# EAGLE design Schematic (EAGLE 6.4)
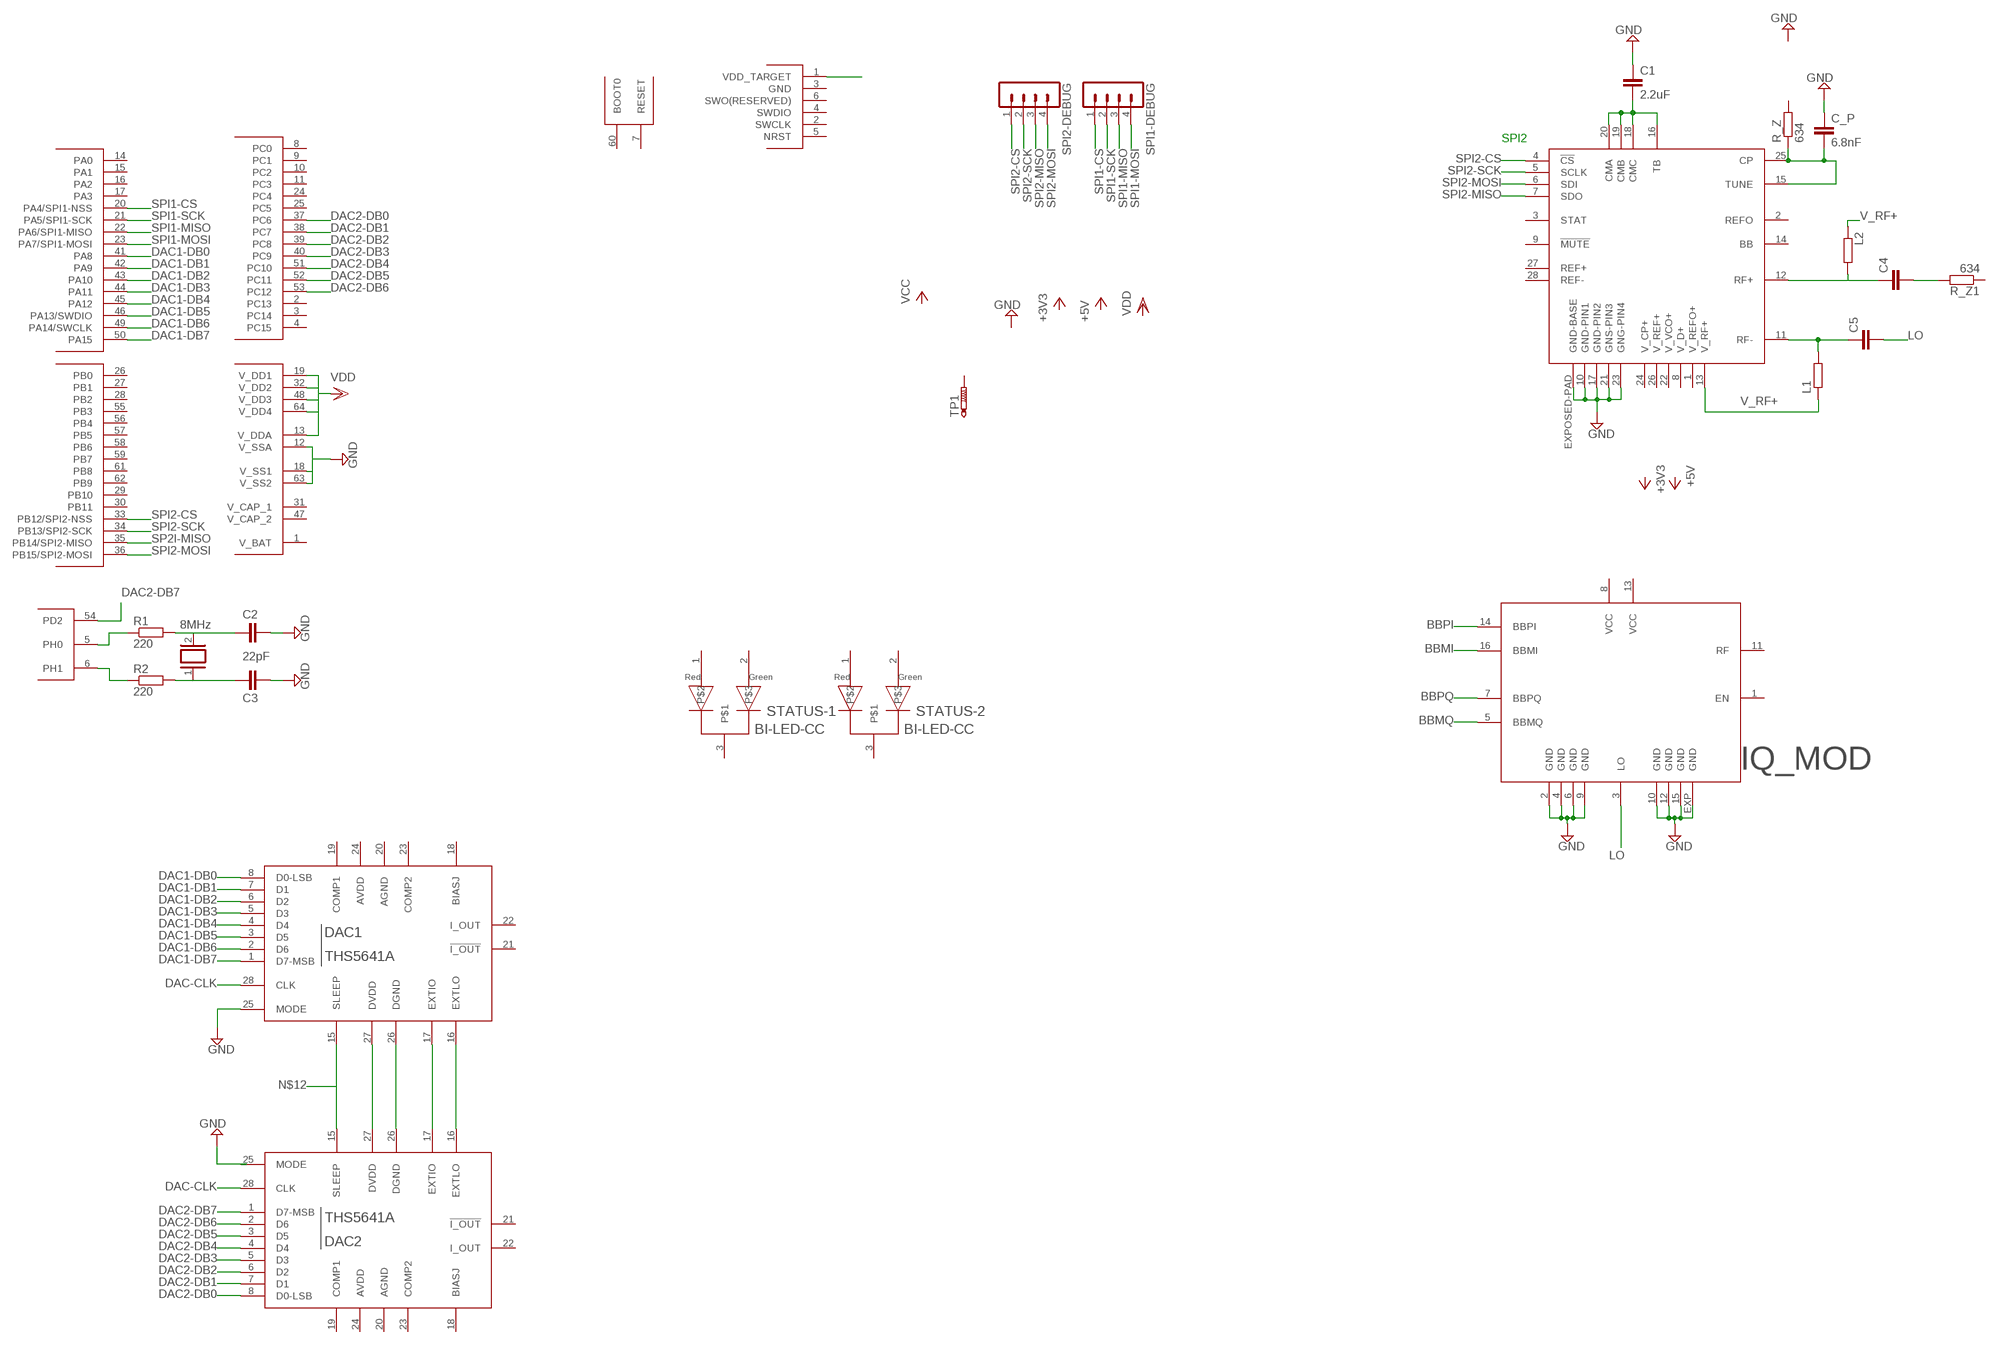
[diagram p0: schematic, sheet 1]

## Parts
C1  2.2uF  C-EUC0603  [C0603]
C2  22pF  C-EUC0603  [C0603]
C3  22pF  C-EUC0603  [C0603]
C4  C-EUC1210  [C1210]
C5  C-EUC1210  [C1210]
C_P  6.8nF  C-EUC0805  [C0805]
DAC1  THS5641A  [SO28]
DAC2  THS5641A  [SO28]
IQ_MOD  LT5568  [QFN-16]
L1  R-EU_R0402  [R0402]
L2  R-EU_R0402  [R0402]
Q1  8MHz  XTAL/S  [QS]
R1  220  R-EU_R0603  [R0603]
R2  220  R-EU_R0603  [R0603]
R_Z  634  R-EU_R0805  [R0805]
R_Z1  634  R-EU_R0805  [R0805]
SPI1-DEBUG  MA04-1  [MA04-1]
SPI2-DEBUG  MA04-1  [MA04-1]
STATUS-1  BI-LED-CC  [SOT-23]
STATUS-2  BI-LED-CC  [SOT-23]
TP1  PTR1PAD1-20Y  [P1-20Y]
U$1  STM32F415RGT6  [LQFP-64]
U$2  SWD-HEADER  [6PIN-HEADER]
U$3  LTC6946  [QFN-28]

## Nets
BBMI: IQ_MOD.16(BBMI)
BBMQ: IQ_MOD.5(BBMQ)
BBPI: IQ_MOD.14(BBPI)
BBPQ: IQ_MOD.7(BBPQ)
DAC1-DB0: DAC1.8(D0-LSB) U$1.41(PORT_A:PA8)
DAC1-DB1: DAC1.7(D1) U$1.42(PORT_A:PA9)
DAC1-DB2: DAC1.6(D2) U$1.43(PORT_A:PA10)
DAC1-DB3: DAC1.5(D3) U$1.44(PORT_A:PA11)
DAC1-DB4: DAC1.4(D4) U$1.45(PORT_A:PA12)
DAC1-DB5: DAC1.3(D5) U$1.46(PORT_A:PA13/SWDIO)
DAC1-DB6: DAC1.2(D6) U$1.49(PORT_A:PA14/SWCLK)
DAC1-DB7: DAC1.1(D7-MSB) U$1.50(PORT_A:PA15)
DAC2-DB0: DAC2.8(D0-LSB) U$1.37(PORT_C:PC6)
DAC2-DB1: DAC2.7(D1) U$1.38(PORT_C:PC7)
DAC2-DB2: DAC2.6(D2) U$1.39(PORT_C:PC8)
DAC2-DB3: DAC2.5(D3) U$1.40(PORT_C:PC9)
DAC2-DB4: DAC2.4(D4) U$1.51(PORT_C:PC10)
DAC2-DB5: DAC2.3(D5) U$1.52(PORT_C:PC11)
DAC2-DB6: DAC2.2(D6) U$1.53(PORT_C:PC12)
DAC2-DB7: DAC2.1(D7-MSB) U$1.54(PD2)
DAC-CLK: DAC1.28(CLK) DAC2.28(CLK)
GND: C1.1 C2.2 C3.2 C_P.1 DAC1.25(MODE) IQ_MOD.2(GND) IQ_MOD.4(GND) IQ_MOD.6(GND) IQ_MOD.9(GND) IQ_MOD.10(GND) IQ_MOD.12(GND) IQ_MOD.15(GND) IQ_MOD.EXP(GND) U$1.12(POWER:V_SSA) U$1.18(POWER:V_SS1) U$1.63(POWER:V_SS2) U$3.10(GND-PIN1) U$3.17(GND-PIN2) U$3.21(GNS-PIN3) U$3.23(GNG-PIN4) U$3.EXPOSED-PAD(GND-BASE)
LO: C5.2 IQ_MOD.3(LO)
N$1: C_P.2 R_Z.1 U$3.15(TUNE) U$3.25(CP)
N$2: C1.2 U$3.16(TB) U$3.18(CMC) U$3.19(CMB) U$3.20(CMA)
N$3: U$2.1(VDD_TARGET)
N$4: C3.1 Q1.1 R2.2
N$5: C2.1 Q1.2 R1.2
N$6: R1.1 U$1.5(PH0)
N$7: R2.1 U$1.6(PH1)
N$8: C5.1 L1.2 U$3.11(RF-)
N$9: C4.1 L2.2 U$3.12(RF+)
N$10: C4.2 R_Z1.2
N$11: DAC1.27(DVDD) DAC2.27(DVDD)
N$12: DAC1.15(SLEEP) DAC2.15(SLEEP)
N$13: DAC1.26(DGND) DAC2.26(DGND)
N$14: DAC1.17(EXTIO) DAC2.17(EXTIO)
N$15: DAC1.16(EXTLO) DAC2.16(EXTLO)
SP2I-MISO: U$1.35(PORT_B:PB14/SPI2-MISO)
SPI1-CS: SPI1-DEBUG.1 U$1.20(PORT_A:PA4/SPI1-NSS)
SPI1-MISO: SPI1-DEBUG.3 U$1.22(PORT_A:PA6/SPI1-MISO)
SPI1-MOSI: SPI1-DEBUG.4 U$1.23(PORT_A:PA7/SPI1-MOSI)
SPI1-SCK: SPI1-DEBUG.2 U$1.21(PORT_A:PA5/SPI1-SCK)
SPI2-CS: SPI2-DEBUG.1 U$1.33(PORT_B:PB12/SPI2-NSS) U$3.4(!CS!)
SPI2-MISO: SPI2-DEBUG.3 U$3.7(SDO)
SPI2-MOSI: SPI2-DEBUG.4 U$1.36(PORT_B:PB15/SPI2-MOSI) U$3.6(SDI)
SPI2-SCK: SPI2-DEBUG.2 U$1.34(PORT_B:PB13/SPI2-SCK) U$3.5(SCLK)
V_RF+: L1.1 L2.1 U$3.13(V_RF+)
VDD: U$1.13(POWER:V_DDA) U$1.19(POWER:V_DD1) U$1.32(POWER:V_DD2) U$1.48(POWER:V_DD3) U$1.64(POWER:V_DD4)
Unconnected: DAC1.18(BIASJ) DAC1.19(COMP1) DAC1.20(AGND) DAC1.21(!I_OUT!) DAC1.22(I_OUT) DAC1.23(COMP2) DAC1.24(AVDD) DAC2.18(BIASJ) DAC2.19(COMP1) DAC2.20(AGND) DAC2.21(!I_OUT!) DAC2.22(I_OUT) DAC2.23(COMP2) DAC2.24(AVDD) DAC2.25(MODE) IQ_MOD.1(EN) IQ_MOD.8(VCC) IQ_MOD.11(RF) IQ_MOD.13(VCC) R_Z1.1 R_Z.2 STATUS-1.1 STATUS-1.2 STATUS-1.3 STATUS-2.1 STATUS-2.2 STATUS-2.3 TP1.TP U$1.1(POWER:V_BAT) U$1.2(PORT_C:PC13) U$1.3(PORT_C:PC14) U$1.4(PORT_C:PC15) U$1.7(FUNCTIONS:RESET) U$1.8(PORT_C:PC0) U$1.9(PORT_C:PC1) U$1.10(PORT_C:PC2) U$1.11(PORT_C:PC3) U$1.14(PORT_A:PA0) U$1.15(PORT_A:PA1) U$1.16(PORT_A:PA2) U$1.17(PORT_A:PA3) U$1.24(PORT_C:PC4) U$1.25(PORT_C:PC5) U$1.26(PORT_B:PB0) U$1.27(PORT_B:PB1) U$1.28(PORT_B:PB2) U$1.29(PORT_B:PB10) U$1.30(PORT_B:PB11) U$1.31(POWER:V_CAP_1) U$1.47(POWER:V_CAP_2) U$1.55(PORT_B:PB3) U$1.56(PORT_B:PB4) U$1.57(PORT_B:PB5) U$1.58(PORT_B:PB6) U$1.59(PORT_B:PB7) U$1.60(FUNCTIONS:BOOT0) U$1.61(PORT_B:PB8) U$1.62(PORT_B:PB9) U$2.2(SWCLK) U$2.3(GND) U$2.4(SWDIO) U$2.5(NRST) U$2.6(SWO(RESERVED)) U$3.1(V_REFO+) U$3.2(REFO) U$3.3(STAT) U$3.8(V_D+) U$3.9(!MUTE!) U$3.14(BB) U$3.22(V_VCO+) U$3.24(V_CP+) U$3.26(V_REF+) U$3.27(REF+) U$3.28(REF-)

## Notes on the sheet
- SPI2

## Library data of the parts
C1 C4 C5 = rcl:C-EU: CAPACITOR, European symbol
C2 C3 C_P = resistor:C-EU: CAPACITOR, European symbol
DAC1 DAC2 = Lynx components:THS5641A
IQ_MOD = Lynx components:LT5568
L1 L2 R_Z R_Z1 = rcl:R-EU_: RESISTOR, European symbol
Q1 = special:XTAL/S: CRYSTAL
R1 R2 = resistor:R-EU_: RESISTOR, European symbol
SPI1-DEBUG SPI2-DEBUG = con-lstb:MA04-1: PIN HEADER; OC_FARNELL: unknown; OC_NEWARK: unknown
STATUS-1 STATUS-2 = Lynx components:BI-LED-CC
TP1 = testpad:PTR1: TEST PIN
U$1 = Lynx components:STM32F415RGT6
U$2 = Lynx components:SWD-HEADER
U$3 = Lynx components:LTC6946

## Board
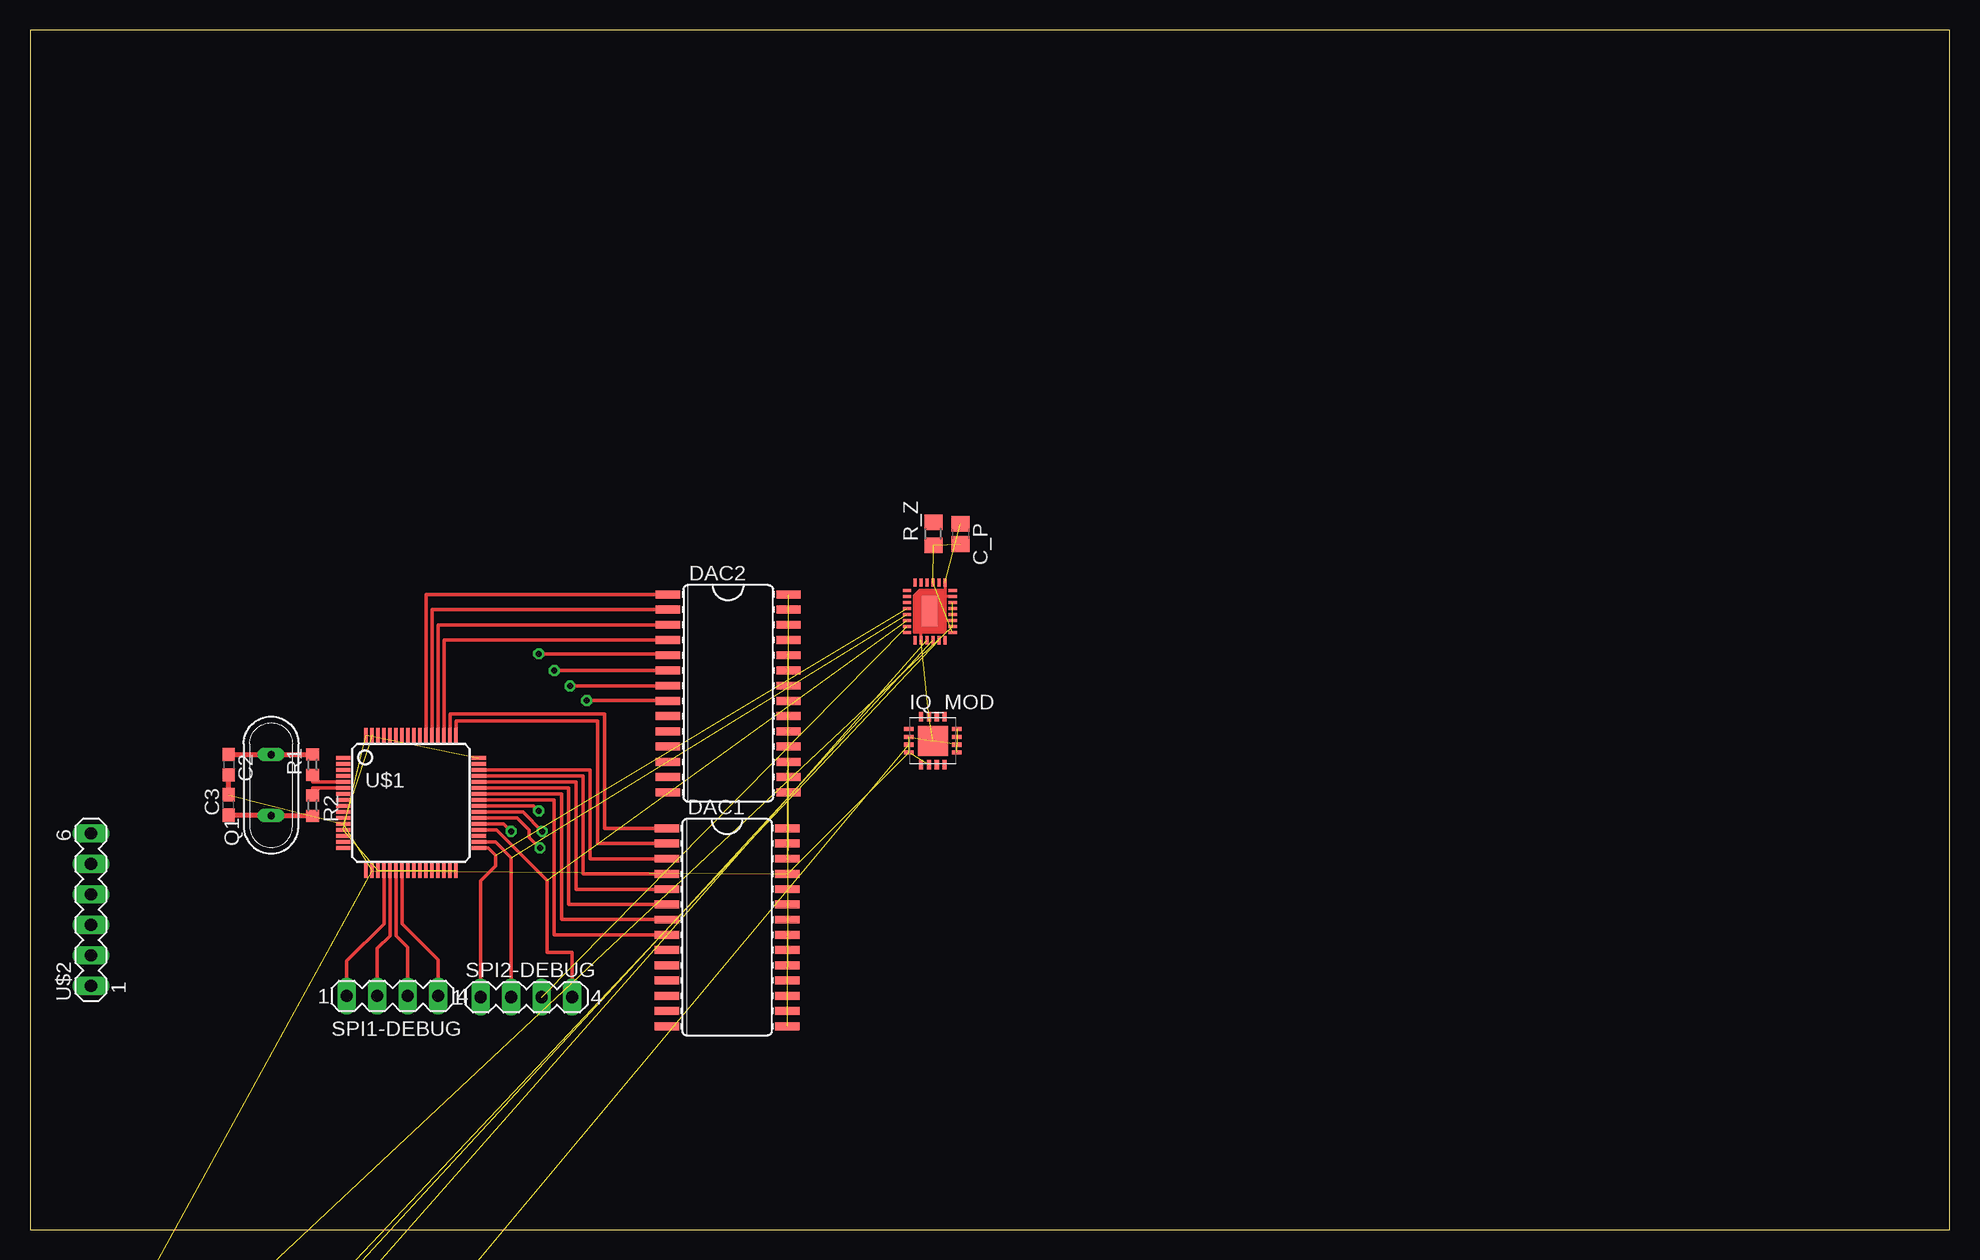
[diagram p1: board, top side]
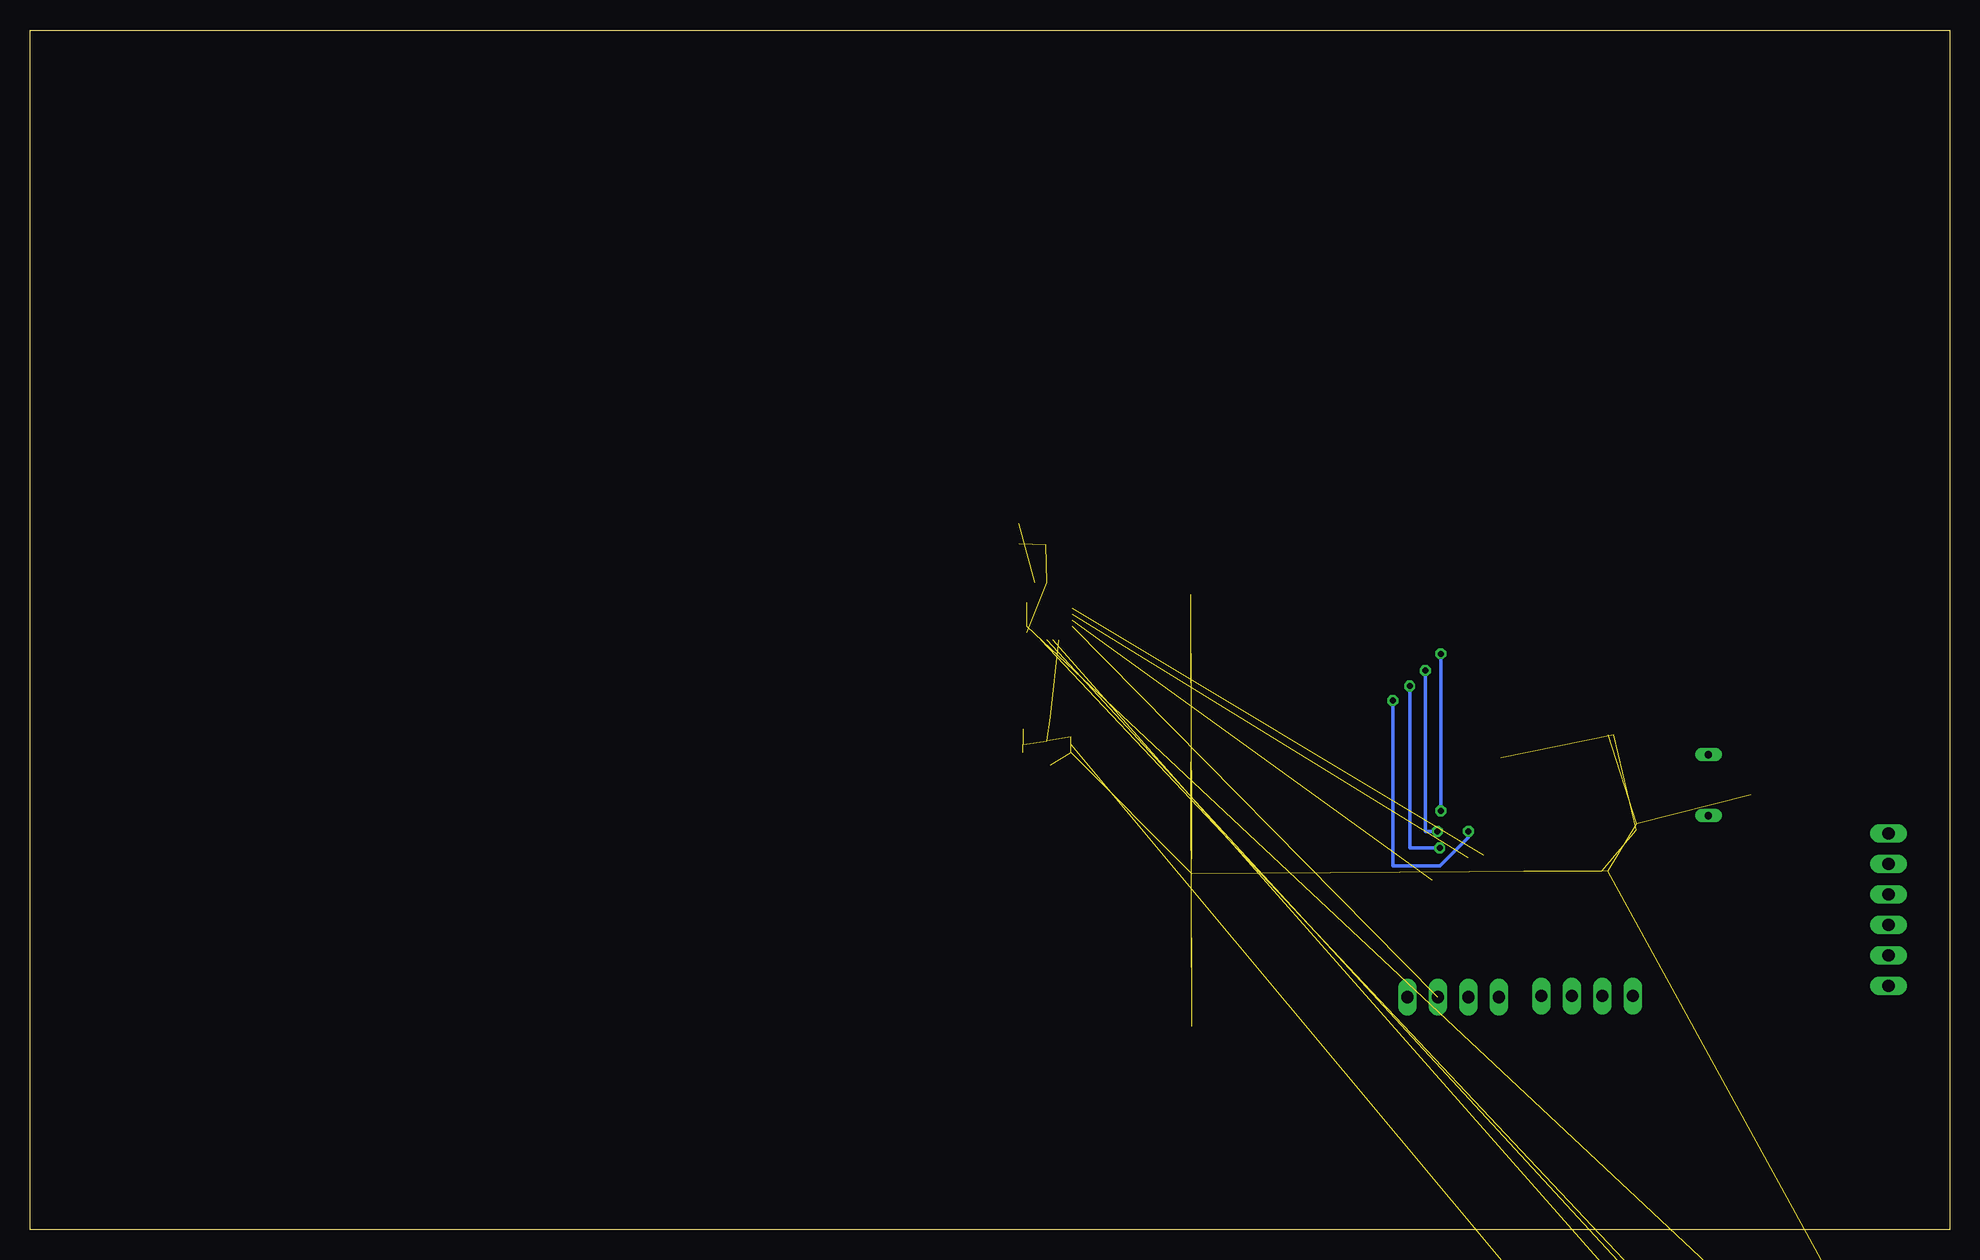
[diagram p2: board, bottom side, seen from below]

Size 160 x 100 mm. Coordinates in mm from the lower left corner, seen from the top.
Outline: 0,0 160,0 160,100 0,100 0,0
Copper layers (1*16): Top 0.035mm / dielectric 1.5mm / Bottom 0.035mm
Design rules "default": minimum track width 10mil, minimum drill 24mil, track to track 8mil, track to pad 8mil, pad to pad 8mil, via to via 8mil, smd to smd 8mil, copper to edge 40mil, drill to drill 8mil, minimum pad ring 10mil, minimum via ring 8mil, stop-mask expansion 4mil, vias tented up to drill 0mil, thermal gap 10mil

### Footprints (pad centres in the part's own frame; a part is rotated, then mirrored left to right if it is on the bottom)
C0603 = smd 1.1 x 1: 1 -0.85,0; 2 0.85,0
C1210 = smd 1.6 x 2.7: 1 -1.4,0; 2 1.4,0
C0805 = smd 1.3 x 1.5: 1 -0.85,0; 2 0.85,0
SO28 = smd 0.66 x 2.032: 1 -8.255,-5.029; 2 -6.985,-5.029; 3 -5.715,-5.029; 4 -4.445,-5.029; 5 -3.175,-5.029; 6 -1.905,-5.029; 7 -0.635,-5.029; 8 0.635,-5.029; 9 1.905,-5.029; 10 3.175,-5.029; 11 4.445,-5.029; 12 5.715,-5.029; 13 6.985,-5.029; 14 8.255,-5.029; 15 8.255,5.029; 16 6.985,5.029; 17 5.715,5.029; 18 4.445,5.029; 19 3.175,5.029; 20 1.905,5.029; 21 0.635,5.029; 22 -0.635,5.029; 23 -1.905,5.029; 24 -3.175,5.029; 25 -4.445,5.029; 26 -5.715,5.029; 27 -6.985,5.029; 28 -8.255,5.029
QFN-16 = smd 0.8 x 0.35: 1 -2,0.975; 2 -2,0.325; 3 -2,-0.325; 4 -2,-0.975; 9 2,-0.975; 10 2,-0.325; 11 2,0.325; 12 2,0.975 | smd 0.35 x 0.8: 5 -0.975,-2; 6 -0.325,-2; 7 0.325,-2; 8 0.975,-2; 13 0.975,2; 14 0.325,2; 15 -0.325,2; 16 -0.975,2 | smd 2.5 x 2.5: EXP 0,0
R0402 = smd 0.7 x 0.9: 1 -0.65,0; 2 0.65,0
QS = drill 0.61 long: 1 -2.54,0; 2 2.54,0
R0603 = smd 1 x 1.1: 1 -0.85,0; 2 0.85,0
R0805 = smd 1.3 x 1.5: 1 -0.95,0; 2 0.95,0
MA04-1 = drill 1.016 long: 1 -3.81,0; 2 -1.27,0; 3 1.27,0; 4 3.81,0
SOT-23 = smd 1 x 1.4: 1 -0.95,-1.1; 2 0.95,-1.1; 3 0,1.1
P1-20Y = drill 2.007 pad 2.54 long: TP 0,0
LQFP-64 = smd 1.2 x 0.3: 1 -5.65,3.75; 2 -5.65,3.25; 3 -5.65,2.75; 4 -5.65,2.25; 5 -5.65,1.75; 6 -5.65,1.25; 7 -5.65,0.75; 8 -5.65,0.25; 9 -5.65,-0.25; 10 -5.65,-0.75; 11 -5.65,-1.25; 12 -5.65,-1.75; 13 -5.65,-2.25; 14 -5.65,-2.75; 15 -5.65,-3.25; 16 -5.65,-3.75; 33 5.65,-3.75; 34 5.65,-3.25; 35 5.65,-2.75; 36 5.65,-2.25; 37 5.65,-1.75; 38 5.65,-1.25; 39 5.65,-0.75; 40 5.65,-0.25; 41 5.65,0.25; 42 5.65,0.75; 43 5.65,1.25; 44 5.65,1.75; 45 5.65,2.25; 46 5.65,2.75; 47 5.65,3.25; 48 5.65,3.75 | smd 0.3 x 1.2: 17 -3.75,-5.65; 18 -3.25,-5.65; 19 -2.75,-5.65; 20 -2.25,-5.65; 21 -1.75,-5.65; 22 -1.25,-5.65; 23 -0.75,-5.65; 24 -0.25,-5.65; 25 0.25,-5.65; 26 0.75,-5.65; 27 1.25,-5.65; 28 1.75,-5.65; 29 2.25,-5.65; 30 2.75,-5.65; 31 3.25,-5.65; 32 3.75,-5.65; 49 3.75,5.65; 50 3.25,5.65; 51 2.75,5.65; 52 2.25,5.65; 53 1.75,5.65; 54 1.25,5.65; 55 0.75,5.65; 56 0.25,5.65; 57 -0.25,5.65; 58 -0.75,5.65; 59 -1.25,5.65; 60 -1.75,5.65; 61 -2.25,5.65; 62 -2.75,5.65; 63 -3.25,5.65; 64 -3.75,5.65
6PIN-HEADER = drill 1.016 long: 1 -6.35,0; 2 -3.81,0; 3 -1.27,0; 4 1.27,0; 5 3.81,0; 6 6.35,0
QFN-28 = smd 0.25 x 0.7: 1 -1.83,-1.9; 2 -1.33,-1.9; 3 -0.83,-1.9; 4 -0.33,-1.9; 5 0.17,-1.9; 6 0.67,-1.9; 7 1.17,-1.9; 8 1.67,-1.9; 15 1.67,1.9; 16 1.17,1.9; 17 0.67,1.9; 18 0.17,1.9; 19 -0.33,1.9; 20 -0.83,1.9; 21 -1.33,1.9; 22 -1.83,1.9 | smd 0.7 x 0.25: 9 2.32,-1.25; 10 2.32,-0.75; 11 2.32,-0.25; 12 2.32,0.25; 13 2.32,0.75; 14 2.32,1.25; 23 -2.48,1.25; 24 -2.48,0.75; 25 -2.48,0.25; 26 -2.48,-0.25; 27 -2.48,-0.75; 28 -2.48,-1.25 | smd 2.54 x 1.27: EXPOSED-PAD -0.08,0

### Placement (x,y rotation side)
C1  -1.7,-24.2 90 top  (outside the outline)
C2  16.55,38.75 270 top
C3  16.55,35.4 90 top
C4  -5.35,-46.85 0 top  (outside the outline)
C5  -5.35,-52 0 top  (outside the outline)
C_P  77.55,58 270 top
DAC1  58.1,25.2 270 top
DAC2  58.2,44.7 270 top
IQ_MOD  75.25,40.75 0 top
L1  -6.35,-42.2 0 top  (outside the outline)
L2  -6.35,-38.85 0 top  (outside the outline)
Q1  20.1,37.05 90 top
R1  23.55,38.75 90 top
R2  23.55,35.35 270 top
R_Z  75.3,58 90 top
R_Z1  -5.8,-56.5 0 top  (outside the outline)
SPI1-DEBUG  30.21,19.47 0 top
SPI2-DEBUG  41.38,19.37 0 top
STATUS-1  -5.4,-63.2 0 top  (outside the outline)
STATUS-2  -5.4,-70.5 0 top  (outside the outline)
TP1  -6.05,-33.3 0 top  (outside the outline)
U$1  31.75,35.56 0 top
U$2  5.08,26.67 90 top
U$3  75,51.46 270 top

### Tracks (layer width: path | path; a pad name or v marks a point on that pad's centre or on a via)
DAC1-DB0
  Top 0.305: U$1.41 43.7,35.81 43.7,24.57 DAC1.8
DAC1-DB1
  Top 0.305: U$1.42 44.3,36.31 44.3,25.84 DAC1.7
DAC1-DB2
  Top 0.305: DAC1.6 44.9,27.11 44.9,36.81 U$1.43
DAC1-DB3
  Top 0.305: U$1.44 45.5,37.31 45.5,28.38 DAC1.5
DAC1-DB4
  Top 0.305: U$1.45 46.1,37.81 46.1,29.64 DAC1.4
DAC1-DB5
  Top 0.305: U$1.46 46.7,38.31 46.7,30.91 DAC1.3
DAC1-DB6
  Top 0.305: DAC1.2 47.3,32.19 47.3,42.4 35.5,42.4 U$1.49
DAC1-DB7
  Top 0.305: U$1.50 35,43 47.9,43 47.9,33.45 DAC1.1
DAC2-DB0  (via drill 0.5 pad 0.61)
  Top 0.305: U$1.37 39.49,33.81 v40.1,33.2 | v46.4,44.1 53.17,44.1 DAC2.8
  Bottom 0.305: v40.1,33.2 40.1,32.7 42.5,30.3 46.4,30.3 v46.4,44.1
DAC2-DB1  (via drill 0.5 pad 0.61)
  Top 0.305: U$1.38 40.59,34.31 41.6,33.3 41.6,32.7 v42.5,31.8 | v45,45.3 53.17,45.3 DAC2.7
  Bottom 0.305: v42.5,31.8 45,31.8 v45,45.3
DAC2-DB2  (via drill 0.5 pad 0.61)
  Top 0.305: U$1.39 41.09,34.81 v42.7,33.2 | v43.7,46.6 DAC2.6
  Bottom 0.305: v42.7,33.2 43.7,33.2 v43.7,46.6
DAC2-DB3  (via drill 0.5 pad 0.61)
  Top 0.305: U$1.40 41.99,35.31 v42.4,34.9 | v42.4,48 53.05,48 DAC2.5
  Bottom 0.305: v42.4,34.9 v42.4,48
DAC2-DB4
  Top 0.305: U$1.51 34.5,49.15 DAC2.4
DAC2-DB5
  Top 0.305: U$1.52 34,50.41 DAC2.3
DAC2-DB6
  Top 0.305: U$1.53 33.5,51.69 DAC2.2
DAC2-DB7
  Top 0.305: U$1.54 33,52.95 DAC2.1
DAC-CLK  (1 unrouted)
GND  (15 unrouted)
  Top 0.254: U$3.17 75.75,50.79 U$3.EXPOSED-PAD | U$3.10 74.25,50.79 U$3.EXPOSED-PAD | U$3.21 76.25,52.79 | U$3.23 76.25,52.79 | 76.25,52.79 U$3.EXPOSED-PAD
  Top 0.406: C3.2 C2.2
LO  (1 unrouted)
N$1  (3 unrouted)
N$2  (4 unrouted)
N$4
  Top 0.406: C3.1 20.1,34.55 Q1.1 R2.2
N$5
  Top 0.406: C2.1 Q1.2 R1.2
N$6
  Top 0.305: U$1.5 23.55,37.31 R1.1
N$7
  Top 0.305: R2.1 23.55,36.81 U$1.6
N$8  (2 unrouted)
N$9  (2 unrouted)
N$10  (1 unrouted)
N$11  (1 unrouted)
N$12  (1 unrouted)
N$13  (1 unrouted)
N$14  (1 unrouted)
N$15  (1 unrouted)
SPI1-CS
  Top 0.305: SPI1-DEBUG.1 26.4,22.4 29.5,25.5 U$1.20
SPI1-MISO
  Top 0.305: U$1.22 30.5,24.5 31.48,23.52 SPI1-DEBUG.3
SPI1-MOSI
  Top 0.305: SPI1-DEBUG.4 34.02,22.48 31,25.5 U$1.23
SPI1-SCK
  Top 0.305: U$1.21 30,24.5 28.94,23.44 SPI1-DEBUG.2
SPI2-CS  (1 unrouted)
  Top 0.305: SPI2-DEBUG.1 37.57,29.07 38.8,30.3 38.8,31.2 38.2,31.8 U$1.33
SPI2-MISO  (1 unrouted)
SPI2-MOSI  (1 unrouted)
  Top 0.305: SPI2-DEBUG.4 45.2,23.1 43.1,23.1 43.1,29.1 38.89,33.31 U$1.36
SPI2-SCK  (1 unrouted)
  Top 0.305: SPI2-DEBUG.2 40.11,30.99 38.8,32.3 U$1.34
V_RF+  (2 unrouted)
VDD  (4 unrouted)